# Altium schematic sheet IWRL6432AOP.SchDoc
size B; SheetNumber: 1; SheetTotal: 5
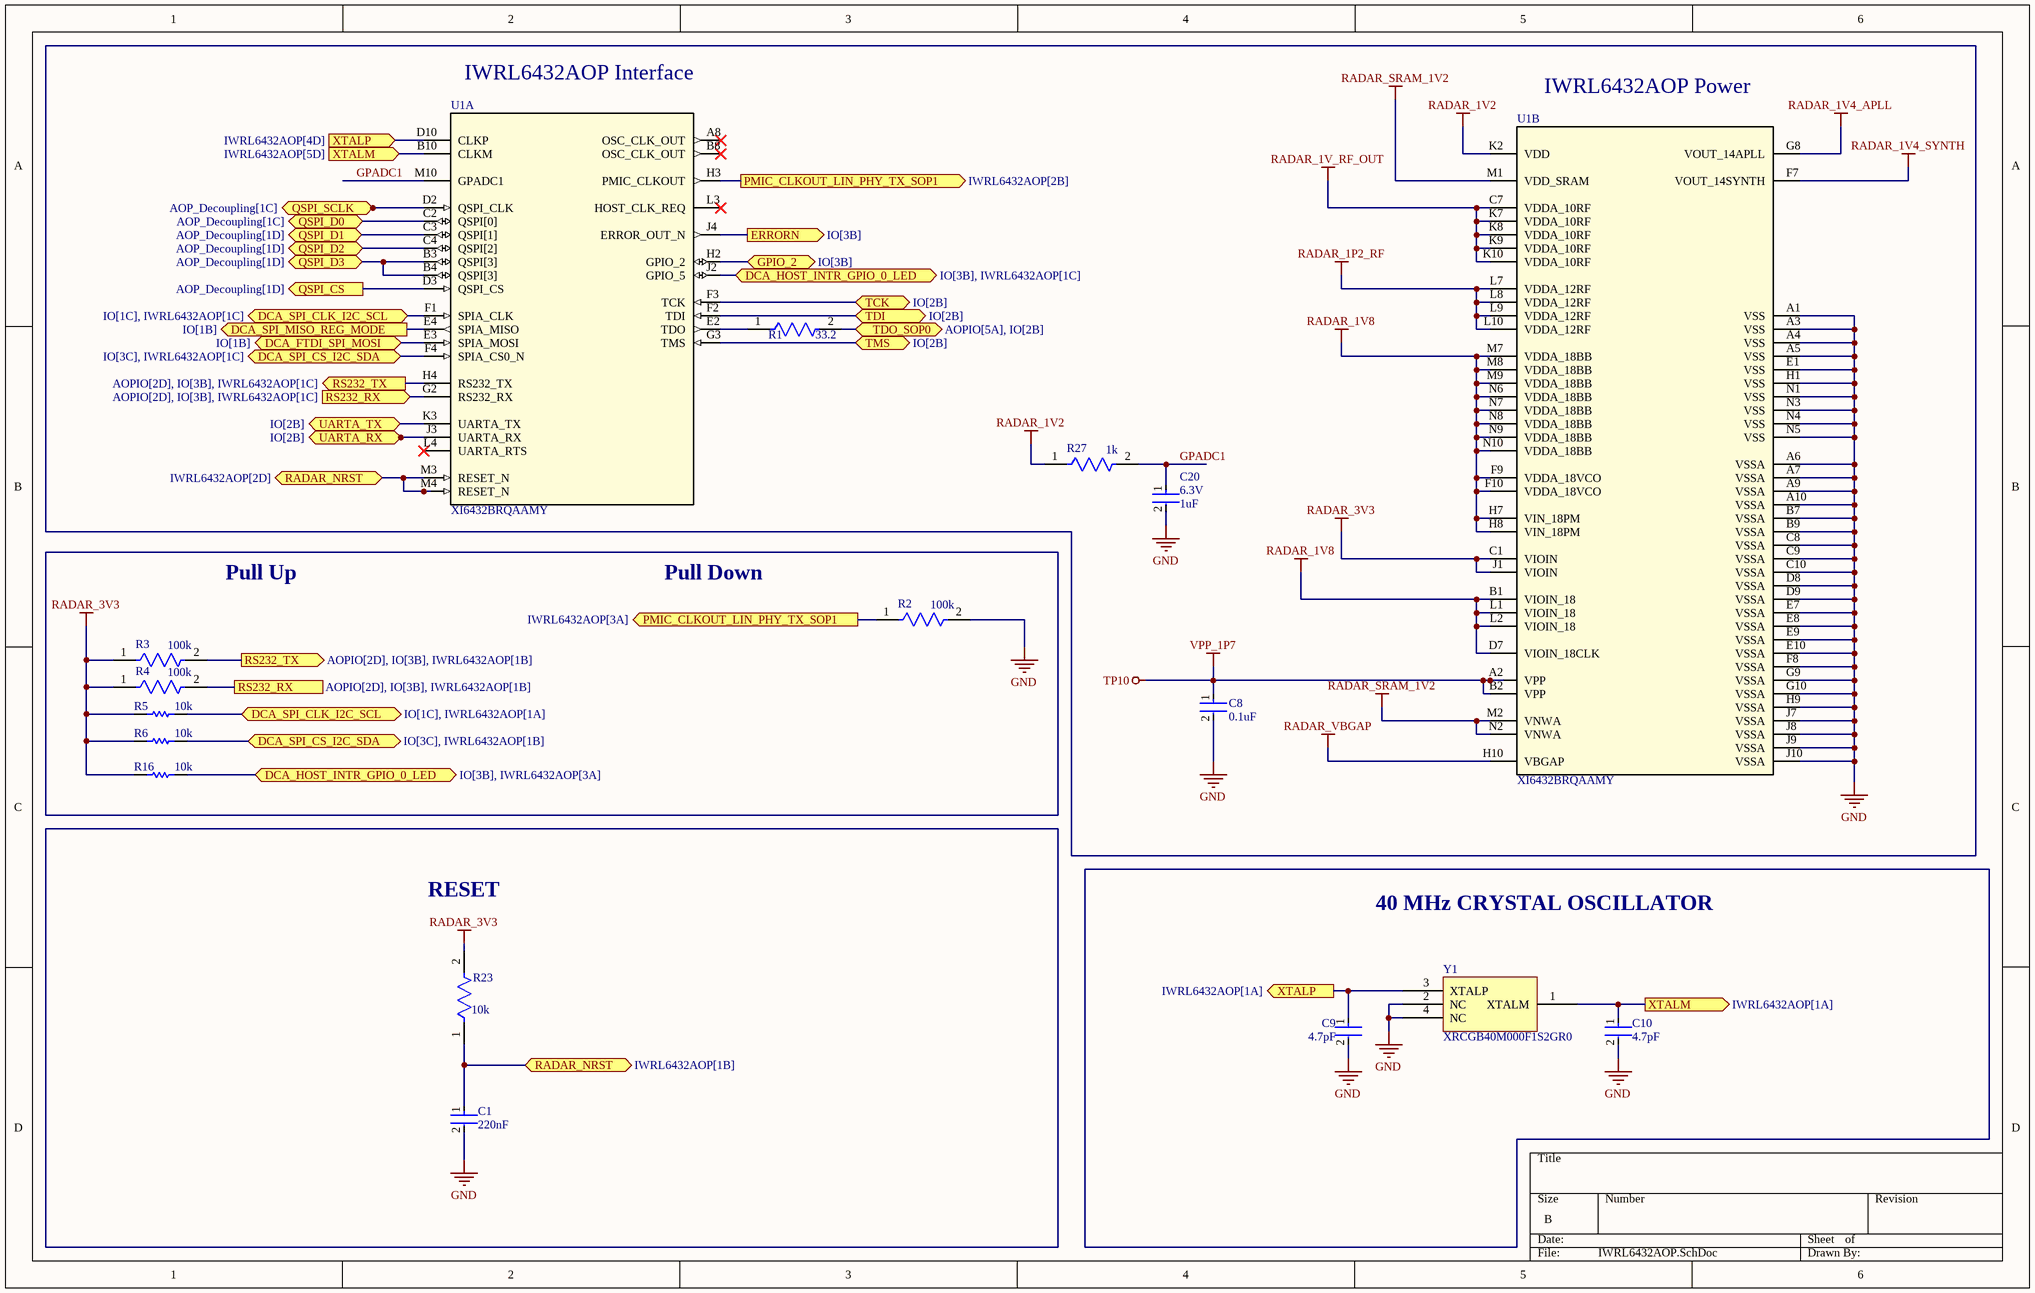
[diagram p0: IWRL6432AOP.SchDoc]

## Parts
C1  Capacitance: 220nF  [FP-CL549-IPC_C]  (hidden comment: CL05B224KO5NNNC)
C8  0.1uF  [FP-C0402-BB-MFG]
C9  Capacitance: 4.7pF  [FP-GJM155-0_05-IPC_C]  (hidden comment: GJM1555C1H4R7BB01D)
C10  Capacitance: 4.7pF  [FP-GJM155-0_05-IPC_C]  (hidden comment: GJM1555C1H4R7BB01D)
C20  Capacitance: 1uF  Voltage Rating (DC): 6.3V  [FP-GRM155-0_05-IPC_C]  (hidden comment: GRM155C80J105KA12D)
R1  Resistance: 33.2  [FP-RT0402-0_35-MFG]  (hidden comment: RT0402FRE0733R2L)
R2  Resistance: 100k  [FP-CRCW0402-C-e3-MFG]  (hidden comment: CRCW0402100KFKEDC)
R3  Resistance: 100k  [FP-CRCW0402-C-e3-MFG]  (hidden comment: CRCW0402100KFKEDC)
R4  Resistance: 100k  [FP-CRCW0402-C-e3-MFG]  (hidden comment: CRCW0402100KFKEDC)
R5  10k  [RESC1005X40X25LL05T10]
R6  10k  [RESC1005X40X25LL05T10]
R16  10k  [RESC1005X40X25LL05T10]
R23  Resistance: 10k  [FP-ERJ1R-MFG]  (hidden comment: ERJ-1RHD1002C)
R27  Resistance: 1k  [FP-RC0402-0_4-IPC_A]  (hidden comment: RC0402FR-071KL)
U1  XI6432BRQAAMY  [AMY0101A-MFG]  (parts A,B of 2)
Y1  XRCGB40M000F1S2GR0  [XRCGB40M000F1S2GR0]

## Ports
DCA_FTDI_SPI_MOSI (bidir, see IO[1B]), DCA_HOST_INTR_GPIO_0_LED (bidir, see IO[3B], IWRL6432AOP[1C]), DCA_HOST_INTR_GPIO_0_LED (bidir, see IO[3B], IWRL6432AOP[3A]), DCA_SPI_CLK_I2C_SCL (bidir, see IO[1C], IWRL6432AOP[1A]), DCA_SPI_CLK_I2C_SCL (bidir, see IO[1C], IWRL6432AOP[1C]), DCA_SPI_CS_I2C_SDA (bidir, see IO[3C], IWRL6432AOP[1B]), DCA_SPI_CS_I2C_SDA (bidir, see IO[3C], IWRL6432AOP[1C]), DCA_SPI_MISO_REG_MODE (out, see IO[1B]), ERRORN (out, see IO[3B]), GPIO_2 (bidir, see IO[3B]), PMIC_CLKOUT_LIN_PHY_TX_SOP1 (out, see IWRL6432AOP[2B]), PMIC_CLKOUT_LIN_PHY_TX_SOP1 (out, see IWRL6432AOP[3A]), QSPI_CS (out, see AOP_Decoupling[1D]), QSPI_D0 (bidir, see AOP_Decoupling[1C]), QSPI_D1 (bidir, see AOP_Decoupling[1D]), QSPI_D2 (bidir, see AOP_Decoupling[1D]), QSPI_D3 (bidir, see AOP_Decoupling[1D]), QSPI_SCLK (bidir, see AOP_Decoupling[1C]), RADAR_NRST (bidir, see IWRL6432AOP[1B]), RADAR_NRST (bidir, see IWRL6432AOP[2D]), RS232_RX (in, see AOPIO[2D], IO[3B], IWRL6432AOP[1C]), RS232_RX (see AOPIO[2D], IO[3B], IWRL6432AOP[1B]), RS232_TX (out, see AOPIO[2D], IO[3B], IWRL6432AOP[1B]), RS232_TX (out, see AOPIO[2D], IO[3B], IWRL6432AOP[1C]), TCK (bidir, see IO[2B]), TDI (bidir, see IO[2B]), TDO_SOP0 (bidir, see AOPIO[5A], IO[2B]), TMS (bidir, see IO[2B]), UARTA_RX (bidir, see IO[2B]), UARTA_TX (bidir, see IO[2B]), XTALM (in, see IWRL6432AOP[5D]), XTALM (out, see IWRL6432AOP[1A]), XTALP (in, see IWRL6432AOP[4D]), XTALP (out, see IWRL6432AOP[1A])

## Nets
GND: C1.2 C8.2 C9.2 C10.2 C20.2 R2.2 U1.A1(VSS) U1.A3(VSS) U1.A4(VSS) U1.A5(VSS) U1.A6(VSSA) U1.A7(VSSA) U1.A9(VSSA) U1.A10(VSSA) U1.B7(VSSA) U1.B9(VSSA) U1.C8(VSSA) U1.C9(VSSA) U1.C10(VSSA) U1.D8(VSSA) U1.D9(VSSA) U1.E1(VSS) U1.E7(VSSA) U1.E8(VSSA) U1.E9(VSSA) U1.E10(VSSA) U1.F8(VSSA) U1.G9(VSSA) U1.G10(VSSA) U1.H1(VSS) U1.H9(VSSA) U1.J7(VSSA) U1.J8(VSSA) U1.J9(VSSA) U1.J10(VSSA) U1.N1(VSS) U1.N3(VSS) U1.N4(VSS) U1.N5(VSS) Y1.2(NC) Y1.4(NC)
RADAR_1P2_RF: U1.L7(VDDA_12RF) U1.L8(VDDA_12RF) U1.L9(VDDA_12RF) U1.L10(VDDA_12RF)
RADAR_1V2: R27.1 U1.K2(VDD)
RADAR_1V4_APLL: U1.G8(VOUT_14APLL)
RADAR_1V4_SYNTH: U1.F7(VOUT_14SYNTH)
RADAR_1V8: U1.B1(VIOIN_18) U1.D7(VIOIN_18CLK) U1.F9(VDDA_18VCO) U1.F10(VDDA_18VCO) U1.H7(VIN_18PM) U1.H8(VIN_18PM) U1.L1(VIOIN_18) U1.L2(VIOIN_18) U1.M7(VDDA_18BB) U1.M8(VDDA_18BB) U1.M9(VDDA_18BB) U1.N6(VDDA_18BB) U1.N7(VDDA_18BB) U1.N8(VDDA_18BB) U1.N9(VDDA_18BB) U1.N10(VDDA_18BB)
RADAR_1V_RF_OUT: U1.C7(VDDA_10RF) U1.K7(VDDA_10RF) U1.K8(VDDA_10RF) U1.K9(VDDA_10RF) U1.K10(VDDA_10RF)
RADAR_3V3: R3.1 R4.1 R5.1 R6.1 R16.1 R23.2 U1.C1(VIOIN) U1.J1(VIOIN)
RADAR_SRAM_1V2: U1.M1(VDD_SRAM) U1.M2(VNWA) U1.N2(VNWA)
RADAR_VBGAP: U1.H10(VBGAP)
TP10: C8.1 U1.A2(VPP) U1.B2(VPP)  [also labelled VPP_1P7]
DCA_FTDI_SPI_MOSI: U1.E3(SPIA_MOSI) ; port DCA_FTDI_SPI_MOSI
DCA_HOST_INTR_GPIO_0_LED: R16.2 U1.J2(GPIO_5) ; port DCA_HOST_INTR_GPIO_0_LED
DCA_SPI_CLK_I2C_SCL: R5.2 U1.F1(SPIA_CLK) ; port DCA_SPI_CLK_I2C_SCL
DCA_SPI_CS_I2C_SDA: R6.2 U1.F4(SPIA_CS0_N) ; port DCA_SPI_CS_I2C_SDA
DCA_SPI_MISO_REG_MODE: U1.E4(SPIA_MISO) ; port DCA_SPI_MISO_REG_MODE
ERRORN: U1.J4(ERROR_OUT_N) ; port ERRORN
GPADC1: C20.1 R27.2 U1.M10(GPADC1)
GPIO_2: U1.H2(GPIO_2) ; port GPIO_2
PMIC_CLKOUT_LIN_PHY_TX_SOP1: R2.1 U1.H3(PMIC_CLKOUT) ; port PMIC_CLKOUT_LIN_PHY_TX_SOP1
QSPI_CS: U1.D3(QSPI_CS) ; port QSPI_CS
QSPI_D0: U1.C2(QSPI[0]) ; port QSPI_D0
QSPI_D1: U1.C3(QSPI[1]) ; port QSPI_D1
QSPI_D2: U1.C4(QSPI[2]) ; port QSPI_D2
QSPI_D3: U1.B3(QSPI[3]) U1.B4(QSPI[3]) ; port QSPI_D3
QSPI_SCLK: U1.D2(QSPI_CLK) ; port QSPI_SCLK
RADAR_NRST: C1.1 R23.1 U1.M3(RESET_N) U1.M4(RESET_N) ; port RADAR_NRST
RS232_RX: R4.2 U1.G2(RS232_RX) ; port RS232_RX
RS232_TX: R3.2 U1.H4(RS232_TX) ; port RS232_TX
TCK: U1.F3(TCK) ; port TCK
TDI: U1.F2(TDI) ; port TDI
TDO_SOP0: R1.2 ; port TDO_SOP0
TMS: U1.G3(TMS) ; port TMS
UARTA_RX: U1.J3(UARTA_RX) ; port UARTA_RX
UARTA_TX: U1.K3(UARTA_TX) ; port UARTA_TX
XTALM: C10.1 U1.B10(CLKM) Y1.1(XTALM) ; port XTALM
XTALP: C9.1 U1.D10(CLKP) Y1.3(XTALP) ; port XTALP
NetR1_1: R1.1 U1.E2(TDO)

Not connected (* = marked no-connect by the designer): U1 A8(OSC_CLK_OUT)* B8(OSC_CLK_OUT)* L3(HOST_CLK_REQ)* L4(UARTA_RTS)*

## Notes on the sheet
- IWRL6432AOP Interface
- IWRL6432AOP Power
- Pull Up
- Pull Down
- RESET
- 40 MHz CRYSTAL OSCILLATOR

## Library data of the parts
C1 = CMP-13271-002972-1: Cap Ceramic 220nF 16V X7R ±10% SMD 0402 +125°C Paper T/R; Length: 1mm; Case Code (Metric): 1005; Dielectric: X7R; Thickness: 0.022inch; Packaging: Tape and Reel; Width: 0.02inch; Voltage Rating: 16V; Max Operating Temperature: 125°C; Tolerance: 10%; Depth: 0.5mm; Radiation Hardening: No; Case Code (Imperial): 0402; Height: 0.5mm; Package Quantity: 1; Mount: Surface Mount; Case/Package: 0402; Min Operating Temperature: -55°C
C8 = CMP-2008-03086-2: CAP CER 0.1UF 10V X7R 0402; Manufacturer Part Number: C0402C104K8RACTU; Manufacturer: Kemet; Capacitance: 0.10 μF; Tolerance: 0.1; Temperature Coefficient: 15%; Value: 0.10 μF; Material: Ceramic; Automotive: No; Temperature Range High: +125°C; Octopart: https://octopart.com/c0402c104k8ractu-kemet-106349; ComponentLink2Description: Datasheet; ComponentLink2URL: https://content.kemet.com/datasheets/KEM_C1002_X7R_SMD.pdf; Temperature: -55°C to +125°C; RoHS: TRUE; Temperature Range Low: -55°C; Temperature Characteristic: X7R; Lead Free: Yes; Height: 0.55mm; Voltage Rating: 10 V; Category: Cap; Device Class L3: Ceramic Capacitors; Digikey Description: CAP CER 0.1UF 10V X7R 0402; Package: C0402-BB; Device Class L1: Passive Components; Ipc Land Pattern Name: CAPC10050X50; Mouser Description: Multilayer Ceramic Capacitors MLCC - SMD/SMT 10volts 0.1uF X7R 10%; Device Class L2: Capacitors
C9 C10 = CMP-2008-03751-2: Multi-Layer Ceramic Capacitor 4.7pF C0G  ±0.1pF 0402 Paper T/R; Voltage Rating (DC): 50V; Max Operating Temperature: 125°C; Radiation Hardening: No; Thickness: 0.022inch; Depth: 0.5mm; Termination: SMD/SMT; Min Operating Temperature: -55°C; Case Code (Imperial): 0402; Voltage Rating: 50V; Dielectric: C0G; Length: 1mm; Package Quantity: 10000; Case/Package: 0402; Width: 0.5mm; Case Code (Metric): 1005; Packaging: Tape and Reel; Height: 0.5mm; Mount: Surface Mount
C20 = CMP-06035-011876-1: Chip Multilayer Ceramic Capacitors for General Purpose, 0402, 1.0uF, X6S, 22%, 10%, 6.3V; Dielectric: X6S; Width: 500um; Length: 1mm; Thickness: 500um; Tolerance: 10%
R1 = CMP-2002-03033-3: NexarPartId: 1272564; Max Power Dissipation: 63mW; Voltage Rating: 50V; Temperature Coefficient: 50ppm/°C; Tolerance: 1%; Packaging: Tape & Reel (TR); Radiation Hardening: No; Military Standard: Not; Contact Plating: Tin; Case Code (Metric): 0402; Max Operating Temperature: 125°C; Height: 350µm; Lead Free: Lead Free; Case/Package: 0402; Width: 508µm; Length: 990.6µm; RoHS: Compliant; Number of Terminations: 2; Voltage Rating (DC): 50V; Min Operating Temperature: -55°C; Power Rating: 63mW; Depth: 500µm; Composition: Thin Film
R2-R4 = CMP-02407-010951-1: RES 100K OHM 1% 1/16W 0402; Temperature Coefficient: 100ppm/°C; Power Rating: 62.5mW; Lead Free: Lead Free; Length: 1mm; Tolerance: 1%; Resistor Type: Thick Film; Contact Plating: Tin; Case/Package: SMD/SMT; Min Operating Temperature: -55°C; RoHS Compliant: Yes; Termination: Wraparound; Max Operating Temperature: 155°C; Mount: Surface Mount
R5 R6 R16 = CMP-2002-07353-1: Part Number: RC0402FR-0710KL; Manufacturer: Yageo / Phycomp
R23 = CMP-2004-03441-2: RES SMD 10K OHM 0.5% 1/20W 0201; Temperature Coefficient: 50ppm/°C; Voltage Rating: 15V; Max Power Dissipation: 50mW; Termination: SMD/SMT; Military Standard: Not; Depth: 0.3mm; Series: ERJ; Lead Free: Lead Free; Packaging: Tape and Reel; Package Quantity: 15000; Max Operating Temperature: 125°C; Width: 0.3mm; Tolerance: 0.5%; Case Code (Imperial): 0201; Length: 0.6mm; Min Operating Temperature: -55°C; Resistor Type: Thick Film; Height: 0.23mm; Mount: Surface Mount; Power Rating: 50mW; Case/Package: 0201; Case Code (Metric): 0603; Number of Terminations: 2
R27 = CMP-2002-07472-3: RES 1K OHM 1% 1/16W 0402; Max Power Dissipation: 63mW; Voltage Rating (DC): 50V; Temperature Coefficient: 100ppm/°C; Power Rating: 62.5mW; Technology: THICK FILM; Size Code: 0402; Series: RC; Length: 1mm; Case/Package: 0402; Features: Moisture Resistant; Termination: SMD/SMT; Case Code (Metric): 1005; Reach SVHC Compliant: Yes; Number of Terminations: 2; Tolerance: 1%; Lead Free: Lead Free; Military Standard: Not; Resistor Type: Thick Film; Max Operating Temperature: 155°C; RoHS Compliant: Yes; Construction: Rectangular; Voltage Rating: 50V; Packaging: Tape and Reel; Height: 0.32mm; Number of Pins: 2; Resistance Tolerance: 1%; Case Code (Imperial): 0402; Depth: 0.5mm; Min Operating Temperature: -55°C; Width: 0.5mm
U1 = XI6432BRQAAMY: Single-chip low-power 57GHz to 63.5GHz industrial mmWave radar sensor with integrated antenna 101-FCCSP -40 to 105; Manufacturer_Name: Texas Instruments; TYPE: TYPE; RefDes: RefDes; Copyright: Copyright (C) 2026 Ultra Librarian. All rights reserved.; Manufacturer_Part_Number: XI6432BRQAAMY
Y1 = XRCGB40M000F1S2GR0: Crystal, 40MHZ, 8PF, SMD, 2MM X 1.6MM;; Manufacturer: Murata; Supplier: DigiKey; Supplier Part Number: 490-XRCGB40M000F1S2GR0CT-ND; Manufacturer Part Number: XRCGB40M000F1S2GR0; Category: Crystals; Stock: 3900; Pricing: 1=0.31, 10=0.273, 25=0.2584, 50=0.2478, 100=0.2376, 250=0.22472, 500=0.21544, 1000=0.20652 (USD); ComponentLink1URL: http://sigma.octopart.com:80/reach_statement/Murata-company-16.pdf?src-supplier=Compliance+Statements; ComponentLink1Description: http://sigma.octopart.com:80/reach_statement/Murata-company-16.pdf?src-supplier=Compliance+Statements